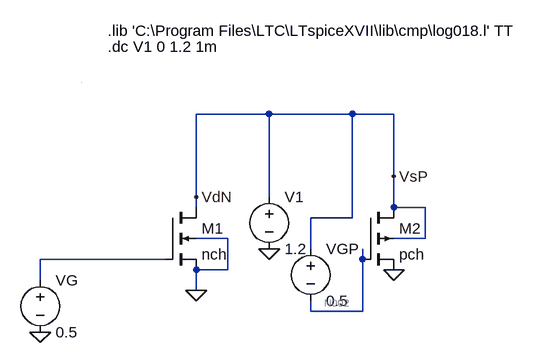
[diagram p0: schematic 5b.asc]
5b.asc, the LTspice schematic file:
Version 4
SHEET 1 880 680
WIRE 288 48 176 48
WIRE 416 48 288 48
WIRE 480 48 416 48
WIRE 480 144 480 48
WIRE 176 176 176 48
WIRE 288 176 288 48
WIRE 176 192 176 176
WIRE 480 192 480 144
WIRE 528 192 480 192
WIRE 416 208 416 48
WIRE 416 208 352 208
WIRE 224 240 176 240
WIRE 528 240 528 192
WIRE 528 240 480 240
WIRE 352 256 352 208
WIRE 128 272 -64 272
WIRE 432 272 432 256
WIRE 224 288 224 240
WIRE 224 288 176 288
WIRE -64 304 -64 272
WIRE 176 320 176 288
WIRE 352 352 352 336
WIRE 432 352 432 272
WIRE 432 352 352 352
WIRE 0 0 0 0
FLAG 288 256 0
FLAG 176 320 0
FLAG 480 288 0
FLAG -64 384 0
FLAG 176 176 VdN
FLAG 480 144 VsP
SYMBOL nmos4 128 192 R0
SYMATTR InstName M1
SYMATTR Value2 l=0.18u w=3u
SYMATTR Value nch
SYMBOL pmos4 432 192 R0
SYMATTR InstName M2
SYMATTR Value2 l=0.18u w=3u
SYMATTR Value pch
SYMBOL voltage 288 160 R0
WINDOW 123 0 0 Left 0
WINDOW 39 0 0 Left 0
SYMATTR InstName V1
SYMATTR Value 1.2
SYMBOL voltage -64 288 R0
WINDOW 123 0 0 Left 0
WINDOW 39 0 0 Left 0
SYMATTR InstName VG
SYMATTR Value 0.5
SYMBOL voltage 352 240 R0
WINDOW 123 0 0 Left 0
WINDOW 39 0 0 Left 0
SYMATTR InstName VGP
SYMATTR Value 0.5
TEXT 40 -80 Left 2 !.lib 'C:\\Program Files\\LTC\\LTspiceXVII\\lib\\cmp\\log018.l' TT
TEXT 40 -56 Left 2 !.dc V1 0 1.2 1m

The netlist it stands for:
* 5b.asc
M1 VsP N001 0 0 nch l=0.18u w=3u
M2 VsP N002 0 VsP pch l=0.18u w=3u
V1 VsP 0 1.2
VG N001 0 0.5
VGP VsP N002 0.5
.model NMOS NMOS
.model PMOS PMOS
.lib standard.mos
.lib 'C:\Program Files\LTC\LTspiceXVII\lib\cmp\log018.l' TT
.dc V1 0 1.2 1m
.backanno
.end

* Results of the author's LTspice run, read from the files saved beside the schematic
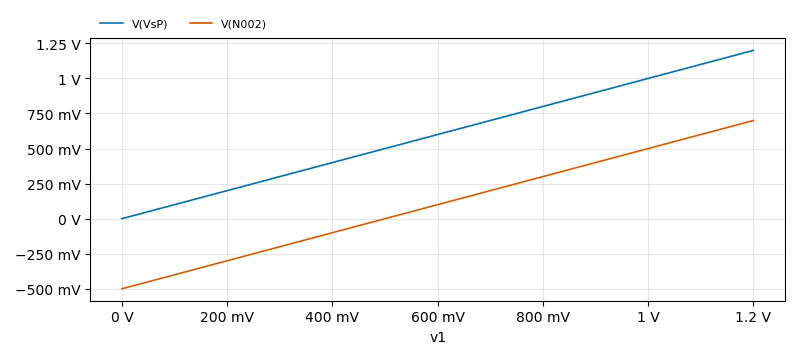
[diagram p1: DC transfer characteristic of 5b.asc, plotted from the saved traces]
* DC transfer characteristic, 1 run:
*   V(VsP): 0 V at v1=0 V, 1.2 V at v1=1.2 V, min 0 V, max 1.2 V
*   V(N002): -500 mV at v1=0 V, 700 mV at v1=1.2 V, min -500 mV, max 700 mV